# EAGLE design basic_pos_neg_v0001 (EAGLE 6.4)
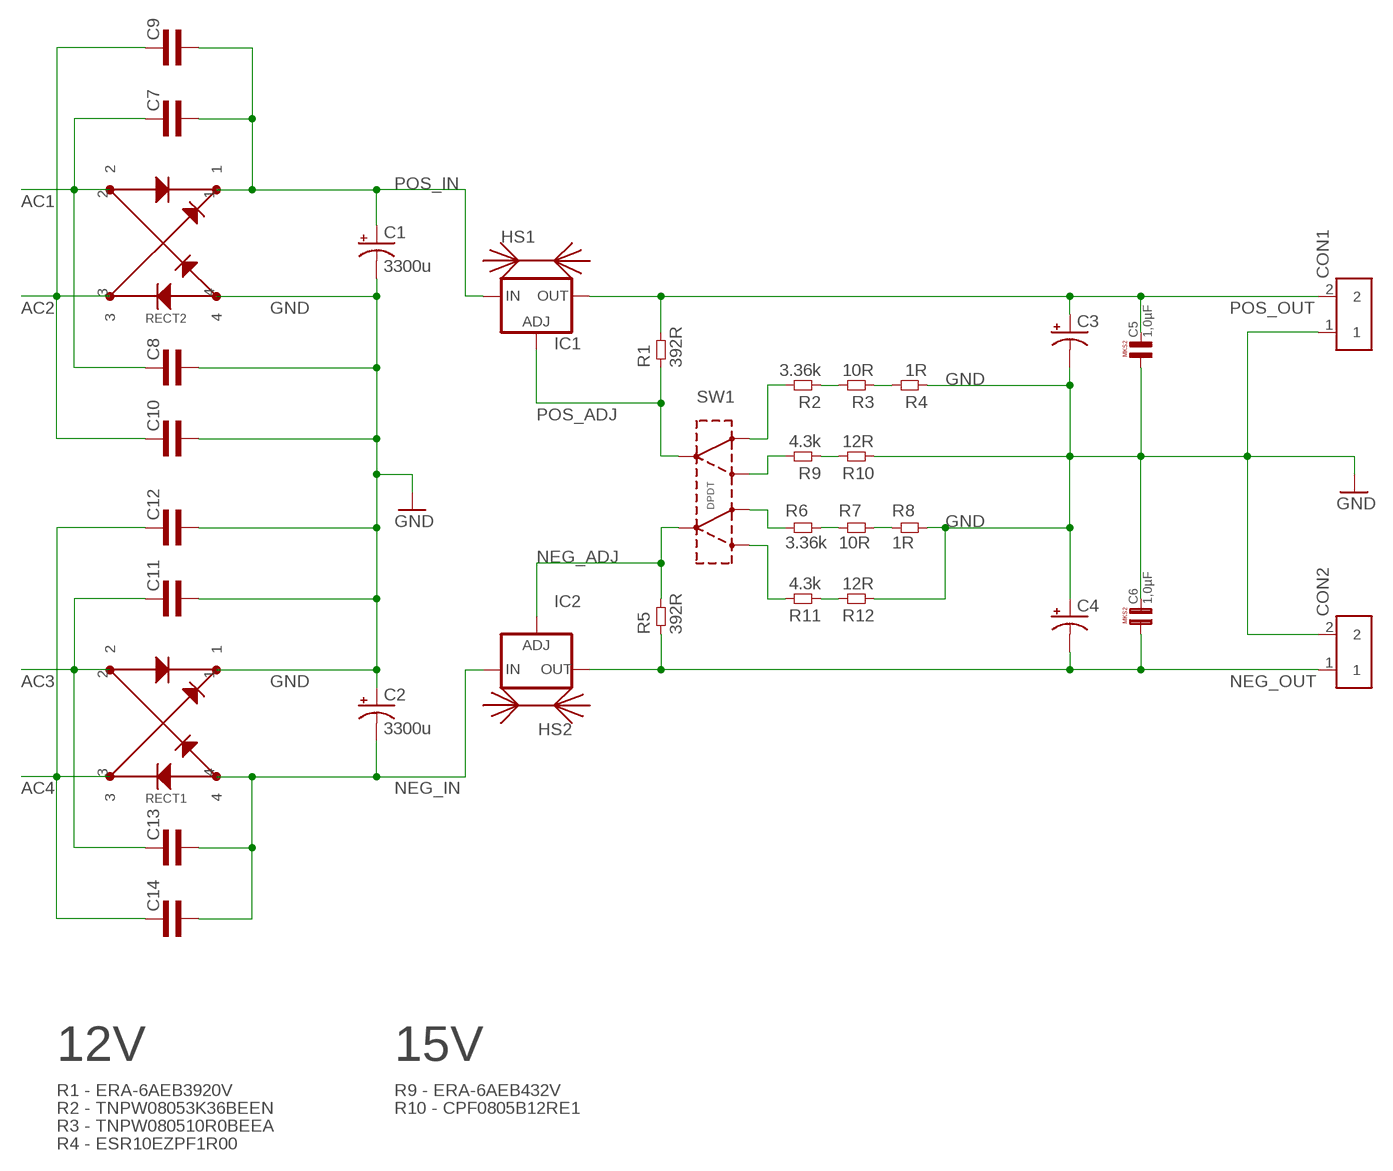
[diagram p0: schematic, sheet 1]

## Parts
C1  3300u  CPOL-USE7.5-18  [E7,5-18]
C2  3300u  CPOL-USE7.5-18  [E7,5-18]
C3  CPOL-USE3.5-8  [E3,5-8]
C4  CPOL-USE3.5-8  [E3,5-8]
C5  1,0µF  [R5B5]
C6  1,0µF  [R5B5]
C7  CAP0805L3  [0805L3]
C8  CAP0805L3  [0805L3]
C9  CAP0805L3  [0805L3]
C10  CAP0805L3  [0805L3]
C11  CAP0805L3  [0805L3]
C12  CAP0805L3  [0805L3]
C13  CAP0805L3  [0805L3]
C14  CAP0805L3  [0805L3]
CON1  TERM_BLOCK_2  [TERM_BLOCK_2]
CON2  TERM_BLOCK_2  [TERM_BLOCK_2]
HS1  HEATSINKTO-220-R  [HEATSINK-TO-220-R]
HS2  HEATSINKTO-220-R  [HEATSINK-TO-220-R]
IC1  LM317TS  [317TS]
IC2  LM337TS  [337TS]
R1  392R  RES0805L3  [0805L3]
R2  3.36k  RES0805L3  [0805L3]
R3  10R  RES0805L3  [0805L3]
R4  1R  RES0805L3  [0805L3]
R5  392R  RES0805L3  [0805L3]
R6  3.36k  RES0805L3  [0805L3]
R7  10R  RES0805L3  [0805L3]
R8  1R  RES0805L3  [0805L3]
R9  4.3k  RES0805L3  [0805L3]
R10  12R  RES0805L3  [0805L3]
R11  4.3k  RES0805L3  [0805L3]
R12  12R  RES0805L3  [0805L3]
RECT1  RECTIFIER_Z4GP206  [RECTIFIER_ABS-4]
RECT2  RECTIFIER_Z4GP206  [RECTIFIER_ABS-4]
SW1  DPDT  [WIRES-2X6-14G]

## Nets
AC1: C7.1 C8.1 RECT2.2
AC2: C9.1 C10.1 RECT2.3
AC3: C11.1 C13.1 RECT1.2
AC4: C12.1 C14.1 RECT1.3
GND: C1.- C2.+ C3.- C4.+ C5.1 C6.2 C8.2 C10.2 C11.2 C12.2 CON1.1 CON2.2 R4.1 R8.2 R10.1 R12.1 RECT1.1 RECT2.4
N$1: R9.2 SW1.3(OUTA2)
N$2: R6.2 R7.1
N$3: R2.2 SW1.1(OUTA1)
N$4: R7.2 R8.1
N$5: R6.1 SW1.6(OUTB1)
N$7: R2.1 R3.2
N$8: R11.2 SW1.4(OUTB2)
N$9: R3.1 R4.2
N$10: R9.1 R10.2
N$11: R11.1 R12.2
NEG_ADJ: IC2.1(ADJ) R5.2 SW1.5(INB)
NEG_IN: C2.- C13.2 C14.2 IC2.2(IN) RECT1.4
NEG_OUT: C4.- C6.1 CON2.1 IC2.3(OUT) R5.1
POS_ADJ: IC1.1(ADJ) R1.1 SW1.2(INA)
POS_IN: C1.+ C7.2 C9.2 IC1.3(IN) RECT2.1
POS_OUT: C3.+ C5.2 CON1.2 IC1.2(OUT) R1.2

## Notes on the sheet
- 12V | 15V
- R1 - ERA-6AEB3920V | R9 - ERA-6AEB432V
- R2 - TNPW08053K36BEEN | R10 - CPF0805B12RE1
- R3 - TNPW080510R0BEEA
- R4 - ESR10EZPF1R00

## Library data of the parts
C1-C4 = rcl:CPOL-US: POLARIZED CAPACITOR, American symbol
C5 C6 = Capacitor-Wima-MKS2-50v:1,0µF
C7-C14 = common:CAP
CON1 CON2 = common:TERM_BLOCK_2
HS1 HS2 = common:HEATSINK
IC1 = v-reg:LM317TS: VOLTAGE REGULATOR
IC2 = v-reg:LM337TS: VOLTAGE REGULATOR
R1-R12 = common:RES
RECT1 RECT2 = my_dac_amp:RECTIFIER_Z4GP206
SW1 = common:DPDT

## Board
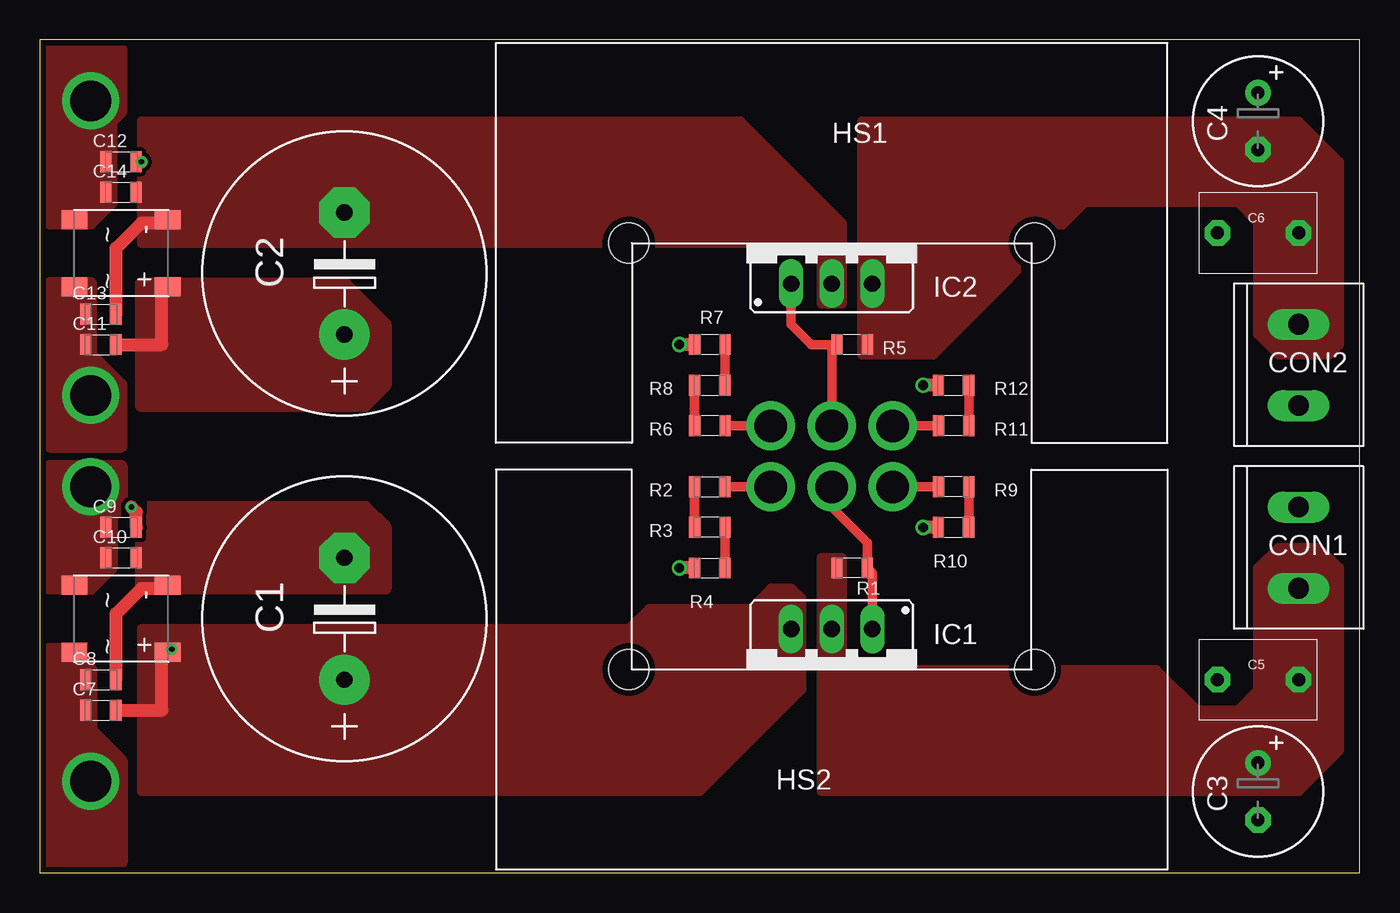
[diagram p1: board, top side]
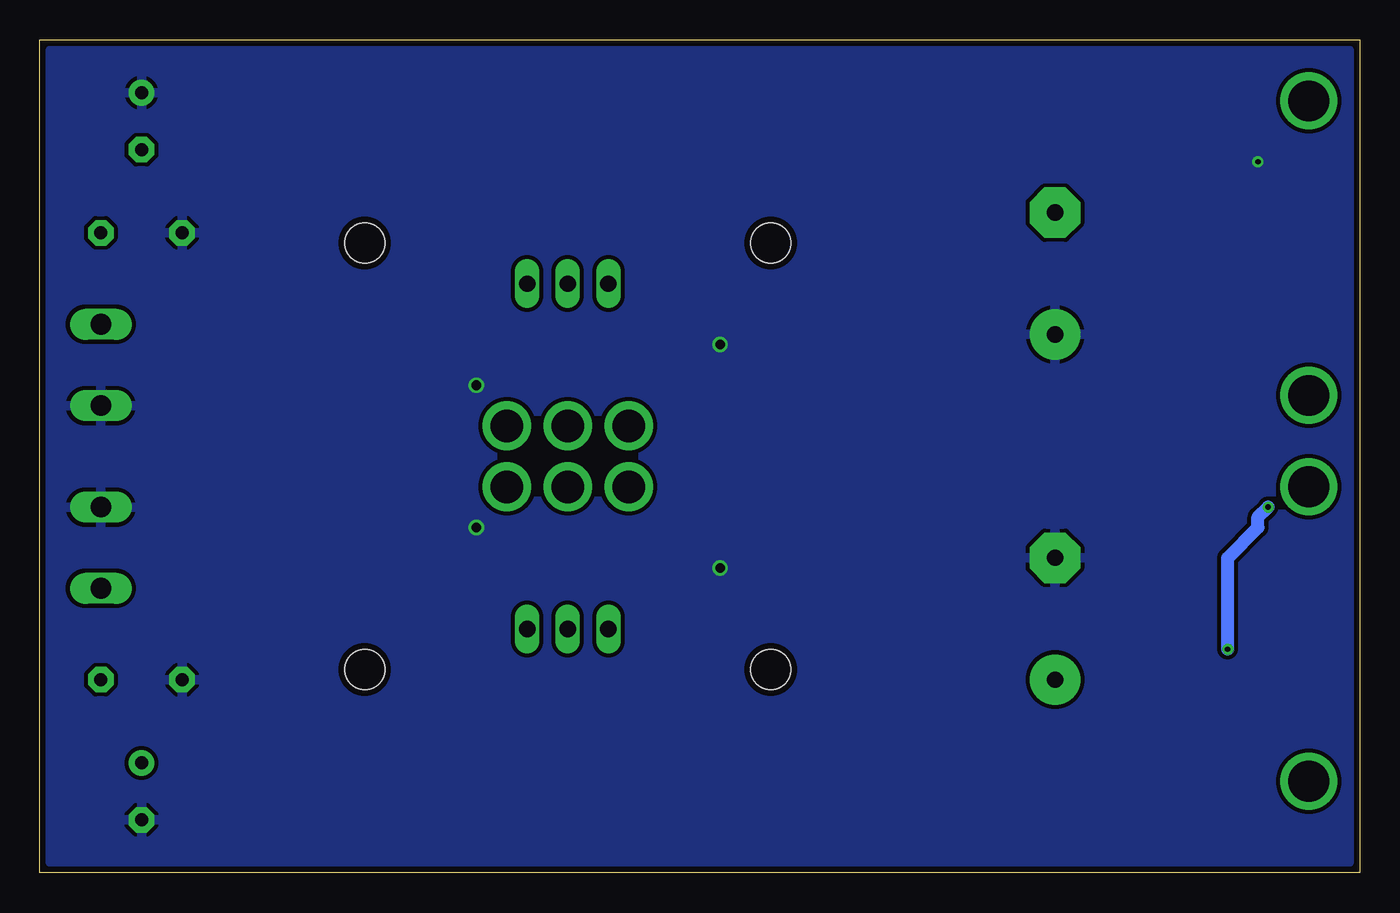
[diagram p2: board, bottom side, seen from below]

Size 82.55 x 52.07 mm. Coordinates in mm from the lower left corner, seen from the top.
Outline: 0,0 82.55,0 82.55,52.07 0,52.07 0,0
Copper layers (1*16): Top 0.035mm / dielectric 1.5mm / Bottom 0.035mm
Design rules "osh_2_layer *": minimum track width 6mil, minimum drill 13mil, track to track 10mil, track to pad 10mil, pad to pad 10mil, via to via 10mil, smd to smd 0mil, copper to edge 15mil, drill to drill 8mil, minimum pad ring 7mil, minimum via ring 7mil, stop-mask expansion 4mil, vias tented up to drill 16mil, thermal gap 10mil

### Footprints (pad centres in the part's own frame; a part is rotated, then mirrored left to right if it is on the bottom)
E7,5-18 = drill 1.016 pad 3.15: + -3.81,0 | drill 1.016 pad 3.15 octagon: - 3.81,0
E3,5-8 = drill 0.813 pad 1.6: + -1.778,0 | drill 0.813 pad 1.6 octagon: - 1.778,0
R5B5 = drill 0.813 pad 1.6 octagon: 1 -2.54,0; 2 2.54,0
0805L3 = smd 0.7 x 1.3: 1 -0.95,0; 2 0.95,0
TERM_BLOCK_2 = drill 1.3 long: 1 -2.54,0; 2 2.54,0
HEATSINK-TO-220-R = hole 2.5: 0,12.7; 0,-12.7
317TS = drill 1.016 long: 1 -2.54,-2.54; 2 0,-2.54; 3 2.54,-2.54
337TS = drill 1.016 long: 1 -2.54,-2.54; 2 0,-2.54; 3 2.54,-2.54
RECTIFIER_ABS-4 = smd 1.2 x 1.6: 1 2.1,2.91; 2 2.1,-2.91; 3 -2.1,-2.91; 4 -2.1,2.91
WIRES-2X6-14G = drill 2.032: 1 -3.81,-1.27; 2 0,-1.27; 3 3.81,-1.27; 4 3.81,2.54; 5 0,2.54; 6 -3.81,2.54

### Placement (x,y rotation side)
C1  19.05,15.88 90 top
C2  19.05,37.46 90 top
C3  76.2,5.08 270 top
C4  76.2,46.99 270 top
C5  76.2,12.06 0 top
C6  76.2,40.01 180 top
C7  3.81,10.16 0 top
C8  3.81,12.06 0 top
C9  5.08,21.59 0 top
C10  5.08,19.68 0 top
C11  3.81,33.02 0 top
C12  5.08,44.45 0 top
C13  3.81,34.93 0 top
C14  5.08,42.54 0 top
CON1  78.74,20.32 270 top
CON2  78.74,31.75 270 top
HS1  49.53,39.37 270 top
HS2  49.53,12.7 90 top
IC1  49.53,12.7 180 top
IC2  49.53,39.37 0 top
R1  50.8,19.05 180 top
R2  41.91,24.13 0 top
R3  41.91,21.59 180 top
R4  41.91,19.05 0 top
R5  50.8,33.02 180 top
R6  41.91,27.94 180 top
R7  41.91,30.48 0 top
R8  41.91,33.02 180 top
R9  57.15,24.13 180 top
R10  57.15,21.59 0 top
R11  57.15,27.94 180 top
R12  57.15,30.48 0 top
RECT1  5.08,38.73 270 top
RECT2  5.08,15.88 270 top
SW1  49.53,25.4 0 top

### Tracks (layer width: path | path; a pad name or v marks a point on that pad's centre or on a via)
AC1  (via drill 2.54)
  other vias: 3.18,5.71
  pour Top (no thermals): 0.63,0.63 0.63,13.97 2.54,13.97 2.54,13.34 3.18,12.7 3.18,8.89 5.08,6.98 5.08,0.63
AC2  (via drill 2.54)
  other vias: 3.18,24.13
  pour Top (no thermals): 0.63,25.4 5.08,25.4 5.08,22.86 4.45,22.23 4.45,19.05 3.18,17.78 0.63,17.78
AC3  (via drill 2.54)
  Top 0.813: RECT1.2 2.42,36.63
  other vias: 3.18,29.84
  pour Top (no thermals): 0.63,26.67 5.08,26.67 5.08,30.48 3.18,32.38 3.18,36.83 0.63,36.83
AC4  (via drill 2.54)
  other vias: 3.18,48.26
  pour Top (no thermals): 0.63,51.43 0.63,40.64 2.54,40.64 3.18,40.64 4.45,41.91 4.45,46.99 5.08,47.62 5.08,51.43
GND  (via drill 0.33, 0.6)
  Top 0.61: R10.1 55.88,21.59 | R4.1 40.64,19.05 | R8.2 40.64,33.02 | R12.1 55.88,30.48
  Top 0.813: C11.2 7.62,33.02 7.62,36.26 | C8.2 4.76,16.19 6.35,17.78 7.79,17.78 | C12.2 v6.35,44.45 | 55.88,21.59 v55.25,21.59 | 40.64,19.05 v40.01,19.05 | 40.64,33.02 v40.01,33.02 | 55.88,30.48 v55.25,30.48
  pour Bottom: 0.63,51.43 81.92,51.43 81.92,0.63 0.63,0.63
  pour Top (no thermals): 6.35,22.86 20.32,22.86 21.59,21.59 21.59,17.78 6.35,17.78
  pour Top (no thermals): 6.35,36.83 19.05,36.83 21.59,34.29 21.59,30.48 20.32,29.21 6.35,29.21
N$1
  Top 0.61: SW1.3 R9.2
N$2
  Top 0.61: R6.2 R7.1
N$3
  Top 0.61: SW1.1 R2.2
N$4
  Top 0.61: R7.2 R8.1
N$5
  Top 0.61: R6.1 SW1.6
N$7
  Top 0.61: R2.1 R3.2
N$8
  Top 0.61: SW1.4 R11.2
N$9
  Top 0.61: R3.1 R4.2
N$10
  Top 0.61: R9.1 R10.2
N$11
  Top 0.61: R12.2 R11.1
NEG_ADJ
  Top 0.61: SW1.5 49.53,32.7 49.69,32.86 | 49.69,32.86 R5.2 | IC2.1 46.99,34.29 48.26,33.02 49.53,33.02 49.69,32.86
NEG_IN
  Top 0.813: C13.2 4.76,39.05 6.35,40.64 7.79,40.64 RECT1.4
  pour Top (no thermals): 6.35,39.37 6.35,46.99 43.82,46.99 50.16,40.64 50.16,35.56 48.9,35.56 48.9,38.1 47.62,39.37
NEG_OUT
  pour Top (no thermals): 51.44,32.38 55.88,32.38 65.41,41.91 74.93,41.91 76.2,40.64 76.2,33.65 77.47,32.38 80.64,32.38 81.28,33.02 81.28,44.45 78.74,46.99 51.44,46.99
POS_ADJ
  Top 0.61: IC1.1 52.07,18.73 R1.1 51.75,20.64 49.53,22.86 SW1.2
POS_IN  (via drill 0.33)
  Top 0.813: C7.2 7.62,10.16 7.62,13.41 RECT2.1 | C9.2 6.03,22.54 v5.71,22.86
  Bottom 0.813: v8.26,13.97 8.26,19.68 6.35,21.59 6.35,22.23 v5.71,22.86
  pour Top (no thermals): 6.35,15.24 36.83,15.24 38.1,16.51 44.45,16.51 45.72,17.78 46.99,17.78 47.62,17.15 47.62,11.43 41.27,5.08 6.35,5.08
POS_OUT
  pour Top (no thermals): 48.9,19.68 48.9,5.08 78.74,5.08 81.28,7.62 81.28,19.05 80.01,20.32 77.47,20.32 76.2,19.05 76.2,11.43 74.93,10.16 72.39,10.16 69.85,12.7 51.44,12.7 50.16,13.97 50.16,19.68